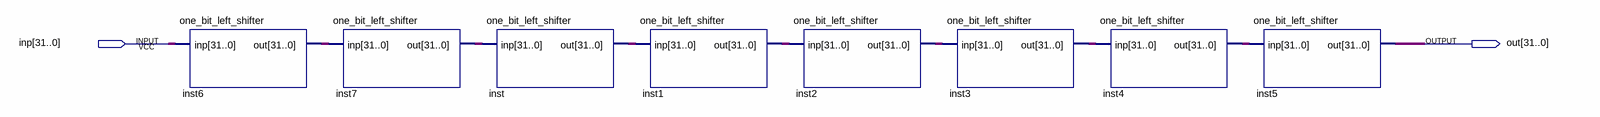
[diagram p0: schematic sheet]
// Quartus schematic l_8_shifter.bdf as structural Verilog: 8 symbols, 2 pins
module l_8_shifter (
  input  [31:0] inp,
  output [31:0] out
);

  wire [31:0] inst1_out, inst2_out, inst3_out, inst4_out, inst6_out, inst7_out, inst_out;

  one_bit_left_shifter inst6 (.inp(inp), .out(inst6_out));
  one_bit_left_shifter inst7 (.inp(inst6_out), .out(inst7_out));
  one_bit_left_shifter inst (.inp(inst7_out), .out(inst_out));
  one_bit_left_shifter inst1 (.inp(inst_out), .out(inst1_out));
  one_bit_left_shifter inst2 (.inp(inst1_out), .out(inst2_out));
  one_bit_left_shifter inst3 (.inp(inst2_out), .out(inst3_out));
  one_bit_left_shifter inst4 (.inp(inst3_out), .out(inst4_out));
  one_bit_left_shifter inst5 (.inp(inst4_out), .out(out));
endmodule
